# EAGLE design PMW3360MouseSensor (EAGLE 9.5.2)
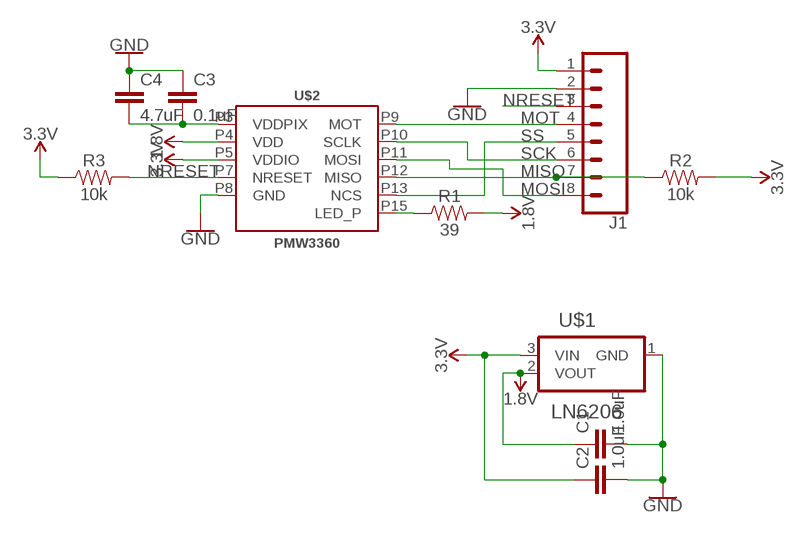
[diagram p0: schematic, sheet 1]

## Parts
C1  1.0uF  1.0UF-0603-16V-10%-X7R  [0603]
C2  1.0uF  1.0UF-0603-16V-10%-X7R  [0603]
C3  0.1uF  0.1UF-0603-25V-5%  [0603]
C4  4.7uF  4.7UF-0603-6.3V-(10%)  [0603]
J1  CONN_08LOCK  [1X08_LOCK]
R1  39  RESISTOR0603  [0603]
R2  10k  10KOHM-0603-1/10W-1%  [0603]
R3  10k  10KOHM-0603-1/10W-1%  [0603]
U$1  LN6206  MCP1700T-3302E/TT  [SOT95P237X112-3N]
U$2  PMW3360  [PMW3360]

## Nets
1.8V: C1.1 R1.2 U$1.2(VOUT) U$2.P4(VDD)
3.3V: C2.1 J1.1 R2.2 R3.1 U$1.3(VIN) U$2.P5(VDDIO)
GND: C1.2 C2.2 C3.1 C4.1 J1.2 U$1.1(GND) U$2.P8(GND)
MISO: J1.7 R2.1 U$2.P12(MISO)
MOSI: J1.8 U$2.P11(MOSI)
MOT: J1.4 U$2.P9(MOT)
N$36: R1.1 U$2.P15(LED_P)
N$48: C3.2 C4.2 U$2.P3(VDDPIX)
NRESET: J1.3 R3.2 U$2.P7(NRESET)
SCK: J1.6 U$2.P10(SCLK)
SS: J1.5 U$2.P13(NCS)
Unconnected: U$2.P1 U$2.P2 U$2.P6 U$2.P14 U$2.P16

## Library data of the parts
C1 C2 = SparkFun-Capacitors:1.0UF: 1µF ceramic capacitors A capacitor is a passive two-terminal electrical component used to store electrical energy temporarily in an electric field.; PROD_ID: CAP-13930
C3 = SparkFun-Capacitors:0.1UF: 0.1µF ceramic capacitors A capacitor is a passive two-terminal electrical component used to store electrical energy temporarily in an electric field.; PROD_ID: CAP-08604
C4 = SparkFun-Capacitors:4.7UF: 4.7µF ceramic capacitors A capacitor is a passive two-terminal electrical component used to store electrical energy temporarily in an electric field.; PROD_ID: CAP-08280
J1 = SparkFun-Connectors:CONN_08: Multi connection point. Often used as Generic Header-pin footprint for 0.1 inch spaced/style header connections On any of the 0.1 inch spaced packages, you can populate with these: Break Away Headers - Straight <https://www.sparkfun.com/products/116> (PRT-00116) Break Away Male Headers - Right Angle <https://www.sparkfun.com/products/553> (PRT-00553) Female Headers <https://www.sparkfun.com/products/115> (PRT-00115) Break Away Headers - Machine Pin <https://www.sparkfun.com/products/117> (PRT-00117) Break Away Female Headers - Swiss Machine Pin <https://www.sparkfun.com/products/743> (PRT-00743) Arduino Stackable Header - 8 Pin <https://www.sparkfun.com/products/9279> (PRT-09279) For SCREWTERMINALS and SPRING TERMINALS visit here: Screw Terimnals on SparkFun.com <https://www.sparkfun.com/search/results?term=Screw+Terminals> (5mm/3.5mm/2.54mm spacing) This device is also useful as a general connection point to wire up your design to another part of your project. Our various solder wires solder well into these plated through hole pads. Hook-Up Wire - Assortment (Stranded, 22 AWG) <https://www.sparkfun.com/products/11375> (PRT-11375) Hook-Up Wire - Assortment (Solid Core, 22 AWG) <https://www.sparkfun.com/products/11367> (PRT-11367) View the entire wire category on our website here <https://www.sparkfun.com/categories/141> Special notes: Molex polarized connector foot print use with SKU : PRT-08231 with associated crimp pins and housings. 1MM SMD Version SKU: PRT-10208 NOTES ON THE VARIANTS LOCK and LOCK_LONGPADS... This footprint was designed to help hold the alignment of a through-hole component (i.e. 6-pin header) while soldering it into place. You may notice that each hole has been shifted either up or down by 0.005 of an inch from it's more standard position (which is a perfectly straight line). This slight alteration caused the pins (the squares in the middle) to touch the edges of the holes. Because they are alternating, it causes a "brace" to hold the component in place. 0.005 has proven to be the perfect amount of "off-center" position when using our standard breakaway headers. Although looks a little odd when you look at the bare footprint, once you have a header in there, the alteration is very hard to notice. Also,if you push a header all the way into place, it is covered up entirely on the bottom side.
R1 = SparkFun-Resistors:RESISTOR: Generic Resistor Package
R2 R3 = SparkFun-Resistors:10KOHM: 10kΩ resistor A resistor is a passive two-terminal electrical component that implements electrical resistance as a circuit element. Resistors act to reduce current flow, and, at the same time, act to lower voltage levels within circuits. - Wikipedia; PROD_ID: RES-00824
U$1 = MCP1700T-3302E_TT:MCP1700T-3302E/TT: Low Quiescent Current LDO; AVAILABILITY: Unavailable; DESCRIPTION: MCP1700 Series 250 mA 3.3 V Fixed Output LDO Voltage Regulator - SOT-23; MF: Microchip; MP: MCP1700T-3302E/TT; PACKAGE: SOT-23-3 Microchip; PRICE: None
U$2 = JH:PMW3360

## Board
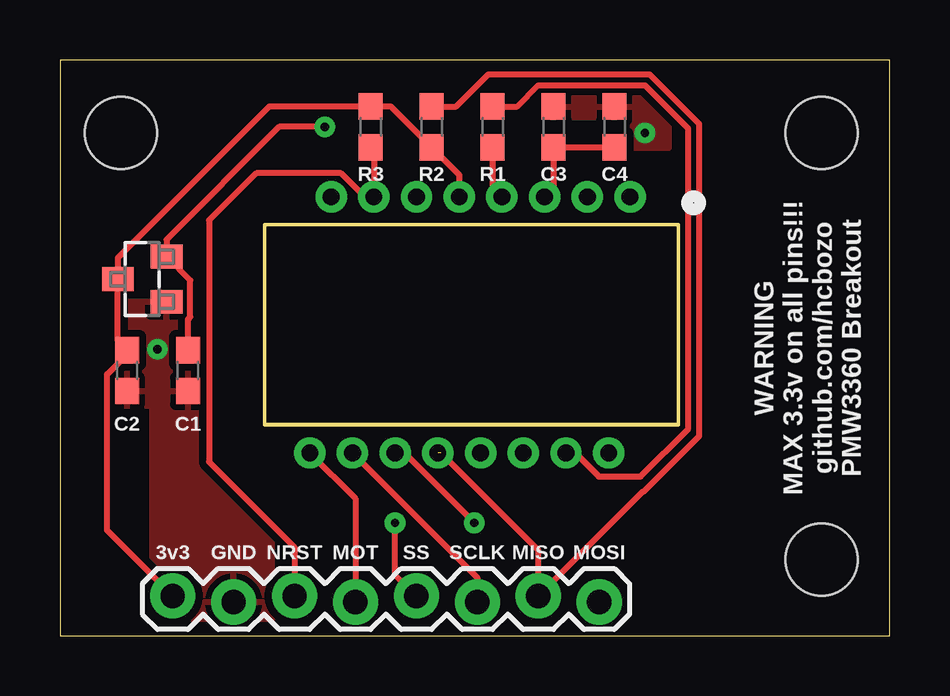
[diagram p1: board, top side]
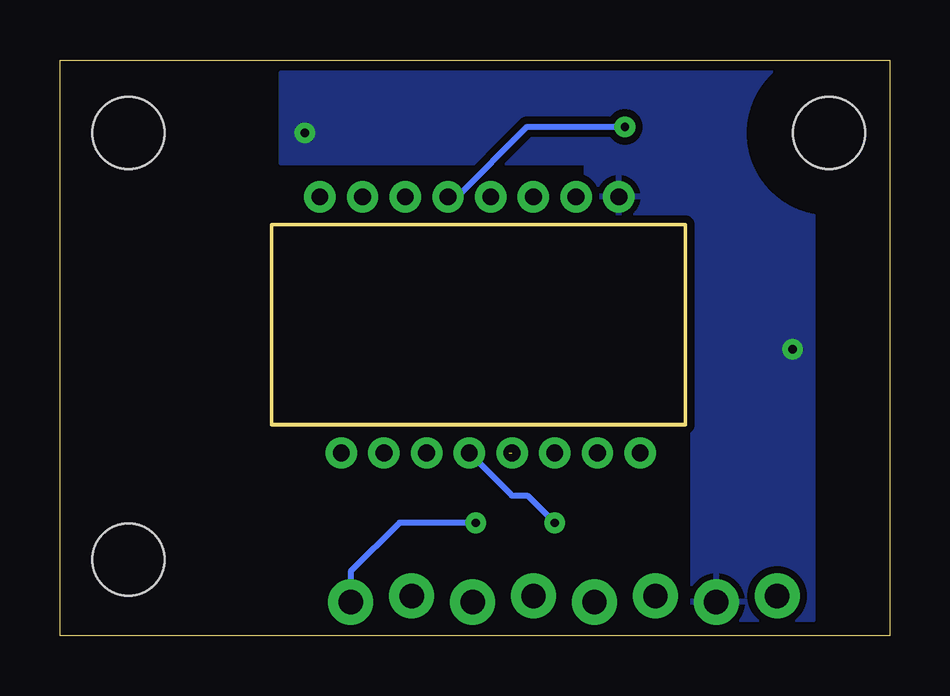
[diagram p2: board, bottom side, seen from below]

Size 34.6 x 24 mm. Coordinates in mm from the lower left corner, seen from the top.
Outline: 0,0 34.6,0 34.6,24 0,24 0,0
Outline: 8.52,17.14 8.52,8.79 25.78,8.79 25.78,17.14 8.52,17.14
Copper layers (1*16): Top 0.035mm / dielectric 1.5mm / Bottom 0.035mm
Design rules "mine": minimum track width 10mil, minimum drill 10mil, track to track 8mil, track to pad 8mil, pad to pad 8mil, via to via 8mil, smd to smd 8mil, copper to edge 8mil, drill to drill 8mil, minimum pad ring 12mil, minimum via ring 10mil, stop-mask expansion 4mil, vias tented up to drill 25mil, thermal gap 10mil
Holes 3 mm at 2.54,20.95 31.75,3.17 31.75,20.95
bRestrict: area 28.8,0.2 to 34.8,6.2; area -0.5,18 to 5.5,24; area 28.8,18 to 34.8,24
Milling: 4 lines

### Footprints (pad centres in the part's own frame; a part is rotated, then mirrored left to right if it is on the bottom)
0603 = smd 1.1 x 1: 1 -0.85,0; 2 0.85,0
1X08_LOCK = drill 1.016 pad 1.88: 1 0,0.127; 2 2.54,-0.127; 3 5.08,0.127; 4 7.62,-0.127; 5 10.16,0.127; 6 12.7,-0.127; 7 15.24,0.127; 8 17.78,-0.127
SOT95P237X112-3N = smd 0.991 x 1.321: 1 -0.94,-1.016; 2 0.94,-1.016; 3 0,1.016
PMW3360 = drill 0.7: P1 13.35,5.34; P2 11.57,5.34; P3 9.79,5.34; P4 8.01,5.34; P5 6.23,5.34; P6 4.45,5.34; P7 2.67,5.34; P8 0.89,5.34; P9 0,-5.34; P10 1.78,-5.34; P11 3.56,-5.34; P12 5.34,-5.34; P13 7.12,-5.34; P14 8.9,-5.34; P15 10.68,-5.34; P16 12.46,-5.34

### Placement (x,y rotation side)
C1  5.33,11.05 270 top
C2  2.79,11.05 270 top
C3  20.57,21.21 270 top
C4  23.11,21.21 270 top
J1  4.7,1.52 0 top
R1  18.03,21.21 270 top
R2  15.49,21.21 270 top
R3  12.95,21.21 270 top
U$1  3.43,14.86 90 top
U$2  10.41,12.95 0 top

### Tracks (layer width: path | path; a pad name or v marks a point on that pad's centre or on a via)
1.8V  (via drill 0.35)
  Top 0.254: R1.2 18.03,18.68 U$2.P4 | C1.1 5.33,13.19 5.44,13.29 5.44,14.81 U$1.2 4.45,16.51 9.14,21.21 v11.05,21.21
  Bottom 0.254: U$2.P4 18.04,18.29 15.12,21.21 v11.05,21.21
3.3V
  Top 0.254: U$2.P5 16.64,19.21 R2.2 13.79,22.06 R3.1 8.72,22.06 2.41,15.75 U$1.3 2.41,12.28 2.58,12.11 | C2.1 2.58,12.11 | 2.58,12.11 2.58,11.51 1.96,10.89 1.96,4.39 J1.1
GND  (via drill 0.35)
  other vias: 24.38,20.95 4.06,11.94
  pour Top (isolate 0.305): 1.91,13.97 8.89,13.97 8.89,0.64 3.81,0.64 3.81,9.53 1.91,9.53
  pour Top (isolate 0.305): 20.32,21.59 23.5,21.59 23.5,20.32 25.4,20.32 25.4,22.86 20.32,22.86
  pour Bottom (isolate 0.305): 8.26,0.64 8.26,17.14 12.7,17.14 12.7,19.68 25.4,19.68 25.4,23.5 3.17,23.5 3.17,0.64
MISO  (1 unrouted)
  Top 0.254: R2.1 16.52,22.06 17.85,23.4 24.57,23.4 26.65,21.32 26.65,8.31 24.32,5.99 24.28,5.99 J1.7 19.94,3.56 15.88,7.61
MOSI  (via drill 0.35)
  Top 0.254: U$2.P11 14.36,7.61 v17.27,4.7
  Bottom 0.254: v17.27,4.7 20.45,4.7 22.48,2.67 J1.8
MOT
  Top 0.254: U$2.P9 12.32,5.71 J1.4
N$36
  Top 0.254: R1.1 19.06,22.06 19.94,22.94 24.39,22.94 26.19,21.14 26.19,8.62 24.2,6.63 22.47,6.63 21.48,7.61 U$2.P15
N$48
  Top 0.254: U$2.P3 20.57,18.66 C3.2 C4.2
NRESET
  Top 0.254: R3.2 13.08,20.23 U$2.P7 12.7,18.29 11.71,19.28 8.18,19.28 6.21,17.31 6.21,7.25 9.78,3.68 J1.3
SCK
  Top 0.254: U$2.P10 17.4,2.41 J1.6
SS  (via drill 0.35)
  Top 0.254: J1.5 13.97,2.54 v13.97,4.7
  Bottom 0.254: v13.97,4.7 15.11,5.84 15.76,5.84 U$2.P13

### Text on the board
tPlace: WARNING / MAX 3.3v on all pins!!! / github.com/hcbozo / PMW3360 Breakout | 3v3 | GND | NRST | MOT | SS | SCLK | MISO | MOSI